# EAGLE design sensor (EAGLE 5.06)
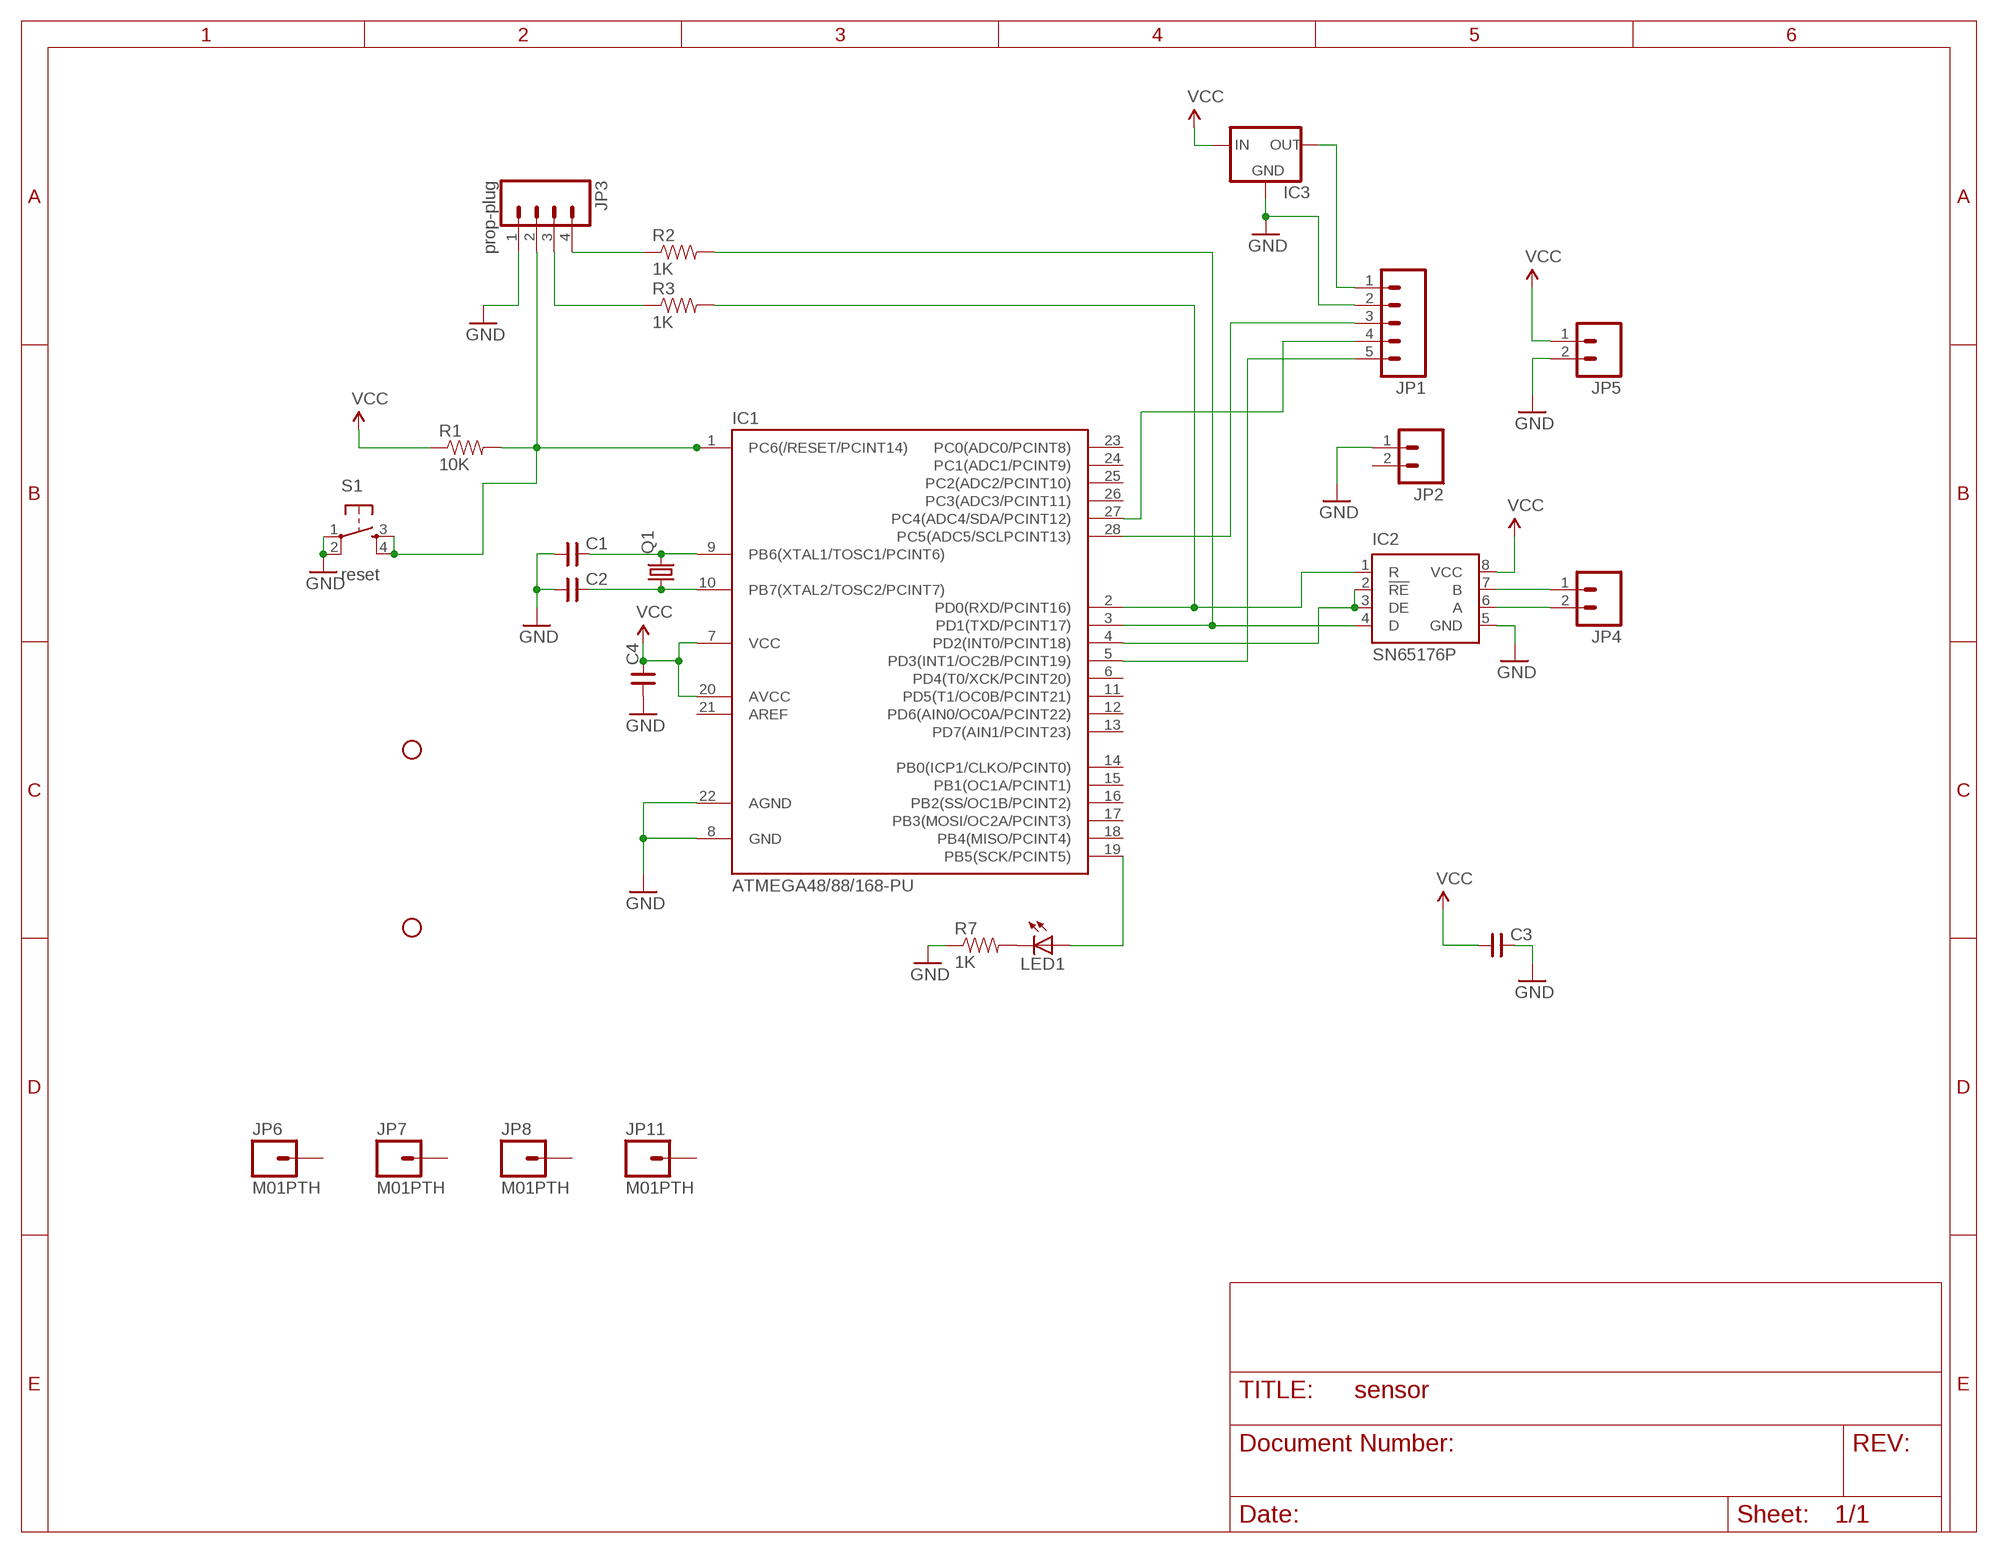
[diagram p0: schematic, sheet 1]

## Parts
C1  CNP-C050-075X030  [C050-075X030]
C2  CNP-C050-075X030  [C050-075X030]
C3  CNP-C050-075X030  [C050-075X030]
C4  CNP-C050-075X030  [C050-075X030]
IC1  ATMEGA48/88/168-PU  [DIL28-3]
IC2  SN65176P  [DIL08]
IC3  78LXX  [78LXX]
JP1  M05LOCK_LONGPADS  [1X05_LOCK_LONGPADS]
JP2  M02LOCK_LONGPADS  [1X02_LOCK_LONGPADS]
JP3  prop-plug  M04PTH  [1X04]
JP4  M02PTH  [1X02]
JP5  M02PTH  [1X02]
JP6  M01PTH  [1X01]
JP7  M01PTH  [1X01]
JP8  M01PTH  [1X01]
JP9  STAND-OFF  [STAND-OFF]
JP10  STAND-OFF  [STAND-OFF]
JP11  M01PTH  [1X01]
LED1  LED5MM  [LED5MM]
Q1  CRYSTALHC49U-V  [HC49U-V]
R1  10K  RESISTORPTH1  [AXIAL-0.3]
R2  1K  RESISTORPTH1  [AXIAL-0.3]
R3  1K  RESISTORPTH1  [AXIAL-0.3]
R7  1K  RESISTORPTH1  [AXIAL-0.3]
S1  reset  TAC_SWITCHPTH  [TACTILE-PTH]

## Nets
GND: C1.1 C2.1 C3.2 C4.1 IC1.8(GND) IC1.22(AGND) IC2.5(GND) IC3.GND JP1.2 JP2.1 JP3.1 JP5.2 R7.P$1 S1.1 S1.2
N$1: C1.2 IC1.9(PB6(XTAL1/TOSC1/PCINT6)) Q1.2
N$2: C2.2 IC1.10(PB7(XTAL2/TOSC2/PCINT7)) Q1.1
N$3: IC1.4(PD2(INT0/PCINT18)) IC2.2(!RE) IC2.3(DE)
N$4: IC3.OUT JP1.1
N$5: IC1.5(PD3(INT1/OC2B/PCINT19)) JP1.5
N$7: JP3.3 R3.P$1
N$9: IC1.1(PC6(/RESET/PCINT14)) JP3.2 R1.P$2 S1.3 S1.4
N$10: IC1.28(PC5(ADC5/SCLPCINT13)) JP1.3
N$11: IC2.7(B) JP4.1
N$12: JP3.4 R2.P$1
N$13: IC1.3(PD1(TXD/PCINT17)) IC2.4(D) R2.P$2
N$14: IC2.6(A) JP4.2
N$15: IC1.2(PD0(RXD/PCINT16)) IC2.1(R) R3.P$2
N$17: IC1.27(PC4(ADC4/SDA/PCINT12)) JP1.4
N$21: LED1.K(C) R7.P$2
N$24: IC1.19(PB5(SCK/PCINT5)) LED1.A
VCC: C3.1 C4.2 IC1.7(VCC) IC1.20(AVCC) IC2.8(VCC) IC3.IN JP5.1 R1.P$1
Unconnected: IC1.6(PD4(T0/XCK/PCINT20)) IC1.11(PD5(T1/OC0B/PCINT21)) IC1.12(PD6(AIN0/OC0A/PCINT22)) IC1.13(PD7(AIN1/PCINT23)) IC1.14(PB0(ICP1/CLKO/PCINT0)) IC1.15(PB1(OC1A/PCINT1)) IC1.16(PB2(SS/OC1B/PCINT2)) IC1.17(PB3(MOSI/OC2A/PCINT3)) IC1.18(PB4(MISO/PCINT4)) IC1.21(AREF) IC1.23(PC0(ADC0/PCINT8)) IC1.24(PC1(ADC1/PCINT9)) IC1.25(PC2(ADC2/PCINT10)) IC1.26(PC3(ADC3/PCINT11)) JP2.2 JP6.1 JP7.1 JP8.1 JP11.1

## Library data of the parts
C1-C4 = cap-master:CNP-: NON-POLARIZED CAP
IC1 = atmega8:ATMEGA48/88/168-PU
IC2 = texas:SN65176: DIFFERENTIAL BUS TRANSCEIVER Source: http://focus.ti.com .. sn65176b.pdf
IC3 = v-reg:78LXX: VOLTAGE REGULATOR
JP1 = SparkFun:M05: Header 5 Standard 5-pin 0.1" header. Use with straight break away headers (SKU : PRT-00116), right angle break away headers (PRT-00553), swiss pins (PRT-00743), machine pins (PRT-00117), and female headers (PRT-00115). Molex polarized connector foot print use with SKU : PRT-08230 with associated crimp pins and housings.
JP2 JP4 JP5 = SparkFun:M02: Header 2 Standard 2-pin 0.1" header. Use with straight break away headers (SKU : PRT-00116), right angle break away headers (PRT-00553), swiss pins (PRT-00743), machine pins (PRT-00117), and female headers (PRT-00115). Molex polarized connector foot print use with SKU : PRT-08233 with associated crimp pins and housings.
JP3 = SparkFun:M04: Header 4 Standard 4-pin 0.1" header. Use with straight break away headers (SKU : PRT-00116), right angle break away headers (PRT-00553), swiss pins (PRT-00743), machine pins (PRT-00117), and female headers (PRT-00115). Molex polarized connector foot print use with SKU : PRT-08231 with associated crimp pins and housings.
JP6-JP8 JP11 = SparkFun:M01: Header 1 Standard 1-pin 0.1" header. Use with straight break away headers (SKU : PRT-00116), right angle break away headers (PRT-00553), swiss pins (PRT-00743), machine pins (PRT-00117), and female headers (PRT-00115).
JP9 JP10 = SparkFun:STAND-OFF: Stand Off This is the mechanical footprint for a #4 phillips button head screw. Use the keepout ring to avoid running the screw head into surrounding components. SKU : PRT-00447
LED1 = SparkFun:LED: LEDs Standard schematic elements and footprints for 5mm, 3mm, 1206, and 0603 sized LEDs. 5mm - Spark Fun Electronics SKU : COM-00529 (and others)
Q1 = crystal:CRYSTAL: CRYSTAL
R1-R3 R7 = SparkFun:RESISTOR: Resistor Basic schematic elements and footprints for 0603, 1206, and PTH 1/10th watt (small) resistors.
S1 = SparkFun:TAC_SWITCH: Momentary Switch Button commonly used for reset or general input. Spark Fun Electronics SKU : COM-00097

## Net classes
0 signal: width 0.381 mm, drill 0.813 mm, clearance 0.254 mm
1 drive: width 1.778 mm, drill 0.813 mm, clearance 0.254 mm

## Board
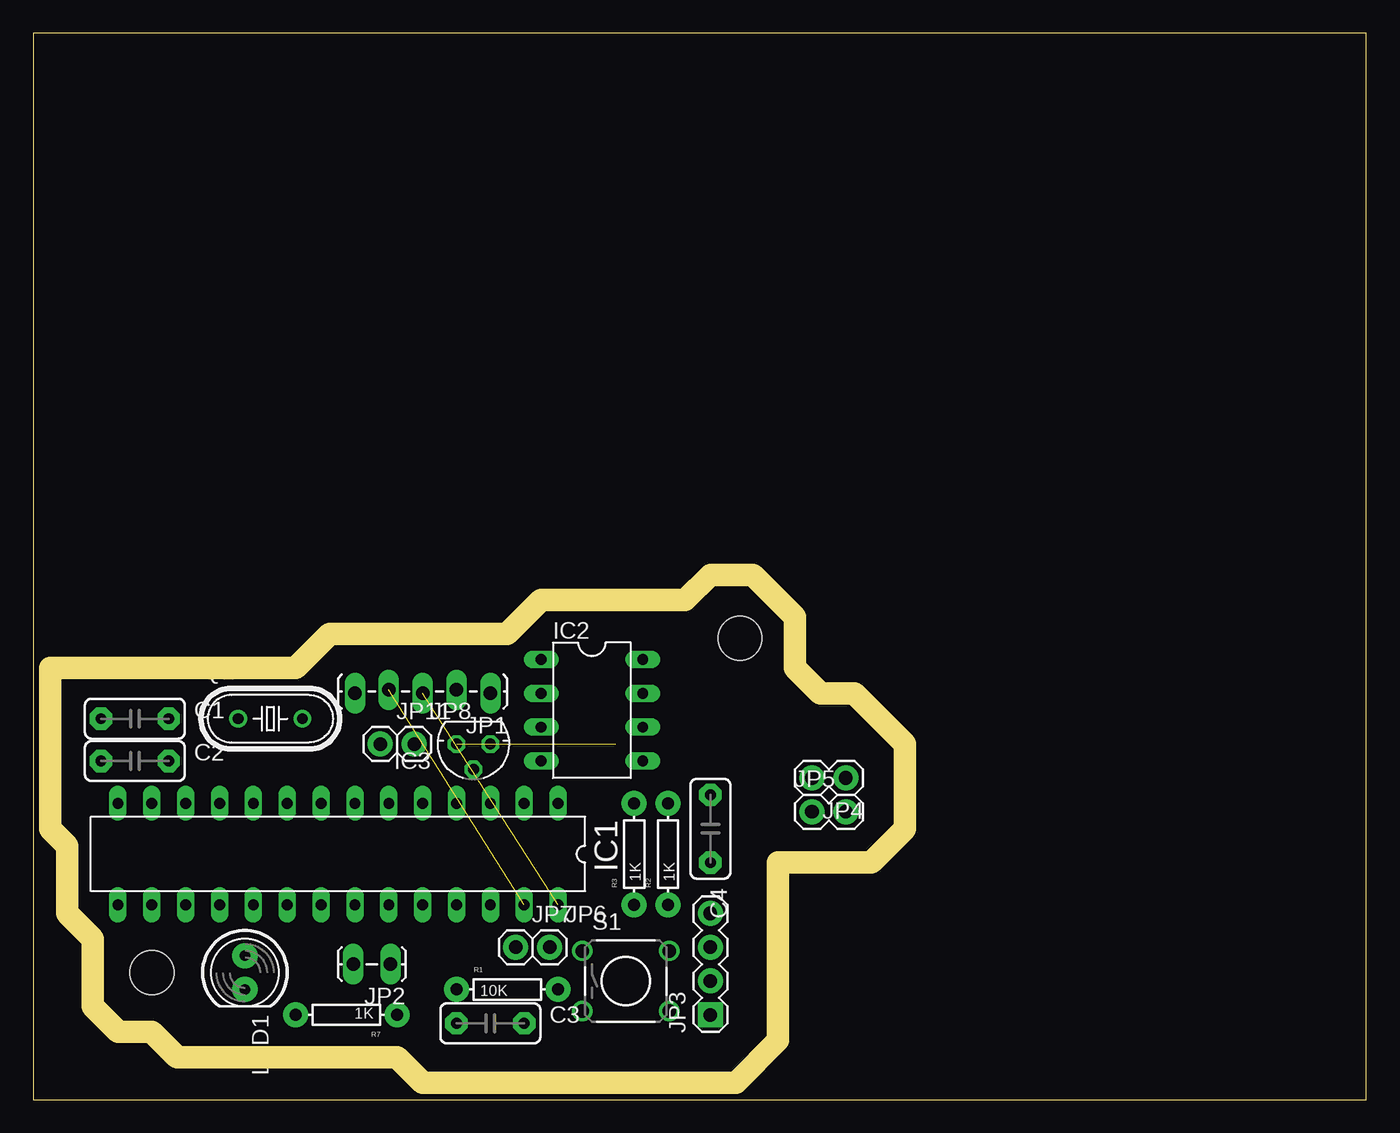
[diagram p1: board, top side]
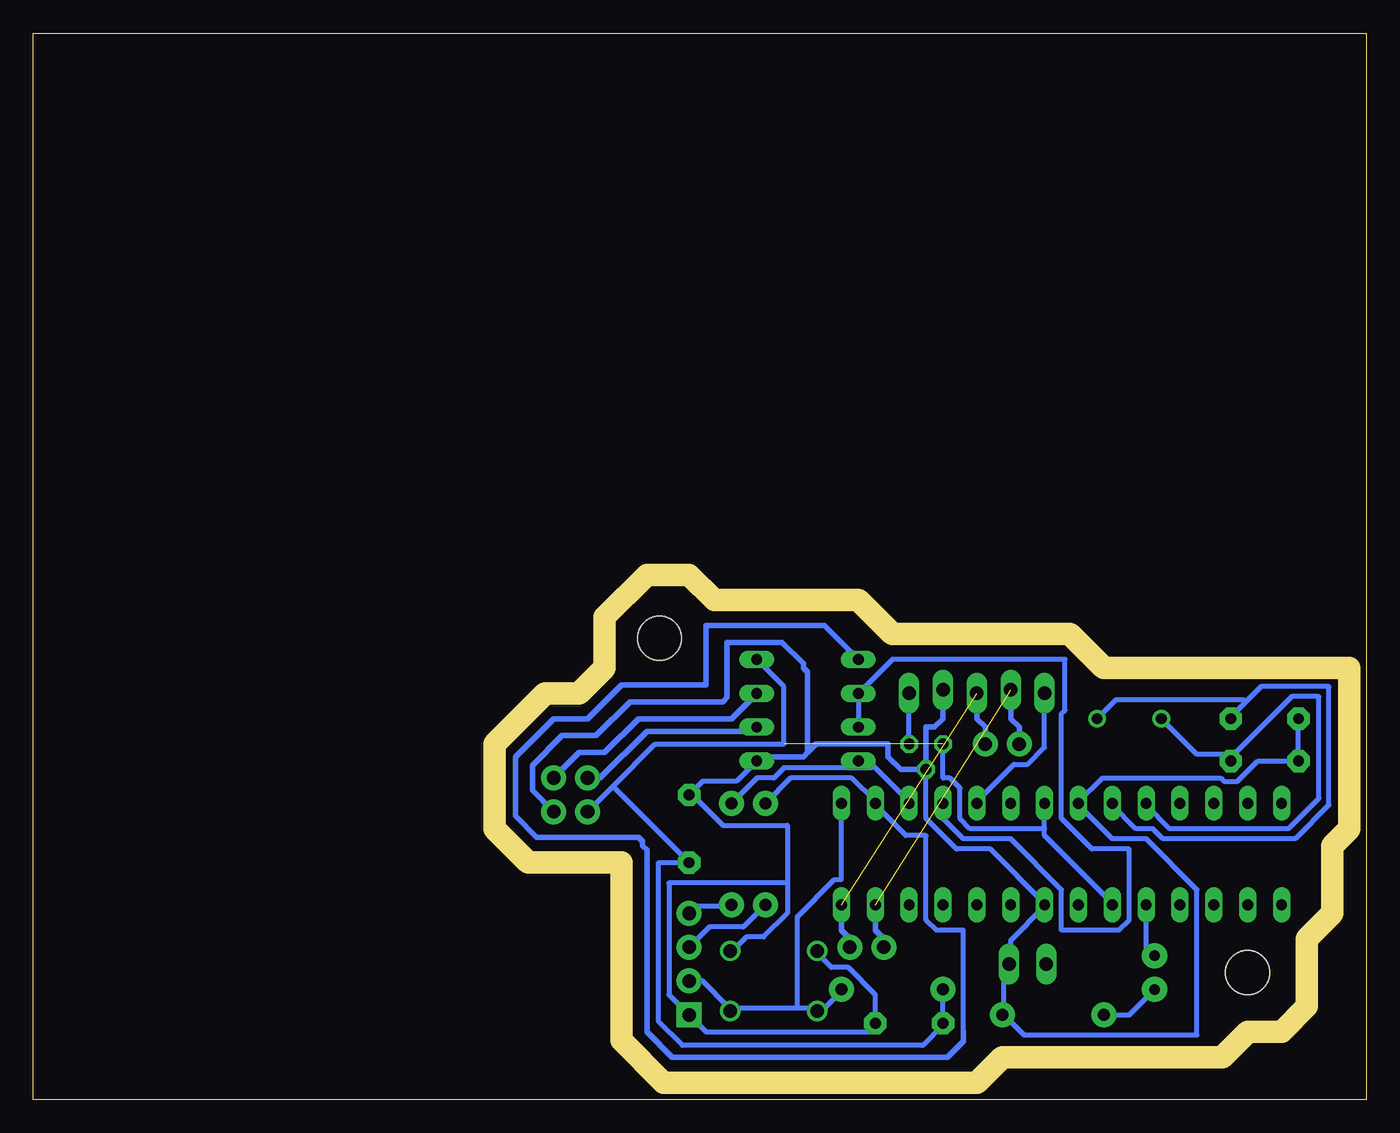
[diagram p2: board, bottom side, seen from below]

Size 100 x 80 mm. Coordinates in mm from the lower left corner, seen from the top.
Outline: 0,0 100,0 100,80 0,80 0,0
Copper layers (1*16): Top 0.035mm / dielectric 1.5mm / Bottom 0.035mm
Design rules "default *": minimum track width 15mil, minimum drill 24mil, track to track 15mil, track to pad 15mil, pad to pad 8mil, via to via 8mil, smd to smd 8mil, copper to edge 63mil, drill to drill 8mil, minimum pad ring 10mil, minimum via ring 8mil, stop-mask expansion 4mil, vias tented up to drill 0mil, thermal gap 10mil
Milling: 28 lines

### Footprints (pad centres in the part's own frame; a part is rotated, then mirrored left to right if it is on the bottom)
C050-075X030 = drill 0.813 pad 1.676 octagon: 1 -2.54,0; 2 2.54,0
DIL28-3 = drill 0.813 long: 1 -16.51,-3.81; 2 -13.97,-3.81; 3 -11.43,-3.81; 4 -8.89,-3.81; 5 -6.35,-3.81; 6 -3.81,-3.81; 7 -1.27,-3.81; 8 1.27,-3.81; 9 3.81,-3.81; 10 6.35,-3.81; 11 8.89,-3.81; 12 11.43,-3.81; 13 13.97,-3.81; 14 16.51,-3.81; 15 16.51,3.81; 16 13.97,3.81; 17 11.43,3.81; 18 8.89,3.81; 19 6.35,3.81; 20 3.81,3.81; 21 1.27,3.81; 22 -1.27,3.81; 23 -3.81,3.81; 24 -6.35,3.81; 25 -8.89,3.81; 26 -11.43,3.81; 27 -13.97,3.81; 28 -16.51,3.81
DIL08 = drill 0.813 long: 1 -3.81,-3.81; 2 -1.27,-3.81; 3 1.27,-3.81; 4 3.81,-3.81; 5 3.81,3.81; 6 1.27,3.81; 7 -1.27,3.81; 8 -3.81,3.81
78LXX = drill 0.813 octagon: GND 0,1.905; IN 1.27,0; OUT -1.27,0
1X05_LOCK_LONGPADS = drill 1.016 long: 1 0,0; 2 2.54,-0.254; 3 5.08,0; 4 7.62,-0.254; 5 10.16,0
1X02_LOCK_LONGPADS = drill 1.016 long: 1 -0.127,0; 2 2.667,0
1X04 = drill 1.016 pad 1.88 square: 1 0,0 | drill 1.016 pad 1.88 round: 2 2.54,0; 3 5.08,0; 4 7.62,0
1X02 = drill 1.016 pad 1.88 round: 1 0,0; 2 2.54,0
1X01 = drill 1.016 pad 1.88 round: 1 0,0
STAND-OFF = hole 3.302: 0,0
LED5MM = drill 0.813 pad 1.88 round: A -1.27,0; K 1.27,0
HC49U-V = drill 0.813 round: 1 -2.413,0; 2 2.413,0
AXIAL-0.3 = drill 0.9 pad 1.88 round: P$1 -3.81,0; P$2 3.81,0
TACTILE-PTH = drill 1.016 round: 1 -3.251,2.261; 2 3.251,2.261; 3 -3.251,-2.261; 4 3.251,-2.261

### Placement (x,y rotation side)
C1  7.62,28.57 0 top
C2  7.62,25.4 0 top
C3  34.29,5.71 0 top
C4  50.8,20.32 270 top
IC1  22.86,18.41 180 top
IC2  41.91,29.21 270 top
IC3  33.02,26.67 180 top
JP1  34.29,30.48 180 top
JP2  26.67,10.16 180 top
JP3  50.8,6.35 90 top
JP4  60.96,24.13 180 top
JP5  58.42,21.59 0 top
JP6  38.73,11.43 0 top
JP7  36.2,11.43 0 top
JP8  28.57,26.67 0 top
JP9  8.89,9.53 0 top
JP10  53.02,34.61 0 top
JP11  26.04,26.67 0 top
LED1  15.88,9.53 270 top
Q1  17.78,28.57 0 top
R1  35.56,8.26 0 top
R2  47.62,18.41 90 top
R3  45.09,18.41 90 top
R7  23.5,6.35 180 top
S1  44.45,8.89 0 top

### Tracks (layer width: path | path; a pad name or v marks a point on that pad's centre or on a via)
GND
  Bottom 0.381: C1.1 C2.1 8.13,25.4 9.65,23.88 10.67,23.88 10.92,24.13 19.81,24.13 21.59,22.35 IC1.8 21.59,22.1 19.05,19.56 16.51,19.56 12.7,15.75 12.7,4.83 25.65,4.83 27.18,6.35 | S1.1 41.15,10.92 40.13,9.91 38.86,9.91 36.83,7.87 C3.2 36.83,5.59 37.34,5.08 49.53,5.08 JP3.1 52.32,7.87 52.32,16.26 43.43,16.26 | 27.18,6.35 27.18,10.16 JP2.1 26.67,10.16 26.67,11.94 24.13,14.48 IC1.22 24.13,14.73 28.19,18.8 30.73,18.8 33.02,21.08 33.02,24.13 IC3.GND | IC2.5 47.24,23.88 49.78,23.88 C4.1 50.55,22.86 48.26,20.57 43.43,20.57 43.43,16.26 | 43.43,16.26 43.43,13.97 45.21,12.19 46.48,12.19 47.5,11.18 S1.2 | 27.18,6.35 R7.P$1
  Bottom 0.406: JP5.2 62.55,23.18 62.55,25.08 60.33,27.3 57.78,27.3 55.24,29.84 48.26,29.84 47.94,30.16 47.94,34.29 43.81,34.29 42.23,32.7 42.23,32.38 41.91,32.07 41.91,26.04 | 41.91,26.04 42.23,25.72 44.77,25.72 45.09,25.4 IC2.5 | 41.91,26.04 41.27,26.67 35.88,26.67 35.88,25.72 34.92,24.77 IC3.GND | JP1.2 31.75,28.57 32.38,27.94 33.02,27.94 33.02,24.13
N$1
  Bottom 0.381: 9.02,29.84 10.16,28.7 C1.2 | 9.02,29.84 7.87,30.99 2.79,30.99 2.79,22.1 5.33,19.56 15.24,19.56 16,20.32 17.27,20.32 19.05,22.1 IC1.9 | Q1.2 18.8,29.97 9.14,29.97 9.02,29.84
N$2
  Bottom 0.381: IC1.10 16.51,22.1 14.73,20.32 5.84,20.32 3.56,22.61 3.56,30.23 5.59,30.23 10.16,25.65 C2.2 10.16,25.91 12.7,25.91 Q1.1
N$3
  Bottom 0.381: IC1.4 31.75,21.08 30.23,19.56 26.67,19.56 22.86,15.75 22.86,12.7 18.54,12.7 17.78,13.46 17.78,18.8 20.57,18.8 22.86,21.08 22.86,28.96 22.61,29.21 22.61,33.02 35.56,33.02 IC2.2 IC2.3
N$4
  Bottom 0.381: IC3.OUT JP1.1
N$5
  Bottom 0.381: JP1.5 24.13,26.42 25.4,25.15 26.42,25.15 29.21,22.35 IC1.5
N$6
  Bottom 0.406: 36.2,12.06 36.83,12.7 36.83,13.97
N$7
  Bottom 0.381: JP3.3 49.28,12.95 46.74,12.95 R3.P$1
N$8
  Bottom 0.406: 38.73,12.06 39.37,12.7 39.37,13.97
N$9
  Bottom 0.381: JP3.2 49.78,8.89 47.75,6.86 S1.4 47.5,6.86 42.67,6.86 | 42.67,6.86 42.67,13.72 39.88,16.51 39.37,16.51 IC1.1 | 42.67,6.86 41.4,6.86 S1.3 41.15,6.86 40.64,6.86 39.37,8.13 R1.P$2
N$10  (1 unrouted)
N$11
  Bottom 0.406: JP4.1 59.05,26.04 57.15,26.04 54.61,28.57 47.62,28.57 IC2.7
N$12
  Bottom 0.381: JP3.4 50.29,14.48 47.75,14.48 R2.P$1
N$13
  Bottom 0.381: IC1.3 34.29,22.35 37.34,25.4 IC2.4 37.08,24.89 43.69,24.89 44.45,24.13 45.72,24.13 R2.P$2
N$14
  Bottom 0.406: IC2.6 46.04,27.62 53.98,27.62 57.47,24.13 JP4.2
N$15
  Bottom 0.381: R3.P$2 43.18,24.13 38.61,24.13 36.83,22.35 IC1.2 36.83,22.1 34.54,19.81 33.02,19.81 33.02,13.46 32.26,12.7 30.23,12.7 30.23,5.08 | 40.64,35.56 IC2.1
  Bottom 0.406: 40.64,35.56 49.53,35.56 49.53,31.11 55.88,31.11 58.42,28.57 60.96,28.57 63.82,25.72 63.82,21.27 62.23,19.68 54.61,19.68 54.29,19.37 54.29,19.05 53.98,18.73 53.98,5.08 52.07,3.17 31.43,3.17 30.23,4.38 30.23,5.08
N$16
  Bottom 0.406: 29.21,29.84 29.21,28.57 28.57,27.94 28.57,27.3
N$17  (1 unrouted)
N$18
  Bottom 0.406: 26.67,29.84 26.67,28.57 26.04,27.94 26.04,27.3
N$21
  Bottom 0.381: LED1.K 17.78,6.35 R7.P$2
N$24
  Bottom 0.381: IC1.19 16.51,10.92 16,10.92 LED1.A
VCC  (1 unrouted)
  Bottom 0.381: R1.P$1 C3.1 31.75,5.59 33.27,4.06 51.31,4.06 53.09,5.84 53.09,17.78 C4.2 56.52,23.5 | IC2.8 43.69,30.99 43.69,26.67 53.34,26.67 56.52,23.5 | 56.52,23.5 JP5.1 | 24.13,20.32 24.13,19.81 19.05,14.73 IC1.20 | 24.13,20.32 IC1.7 | IC3.IN 31.75,24.13 31.24,24.13 30.48,23.37 30.48,21.08 29.72,20.32 24.13,20.32